# EAGLE schematic D-FlipFlop-countdown (EAGLE 9.6.2)
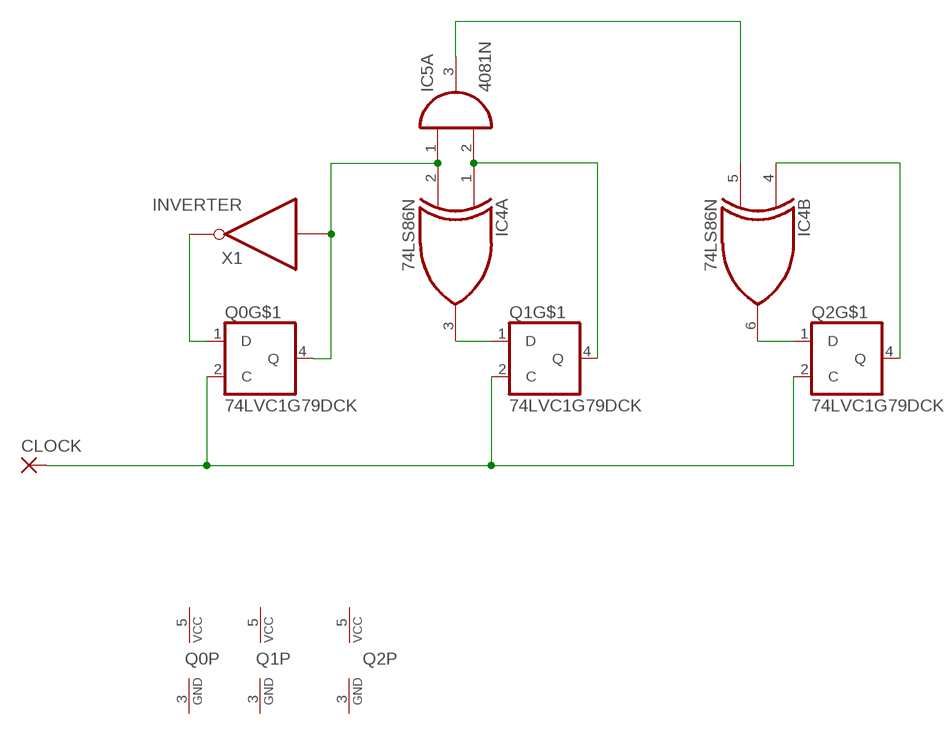
[diagram p0: schematic, sheet 1]

## Parts
CLOCK  1,6/0,8  [1,6/0,8]
IC4  74LS86N  [DIL14]
IC5  4081N  [DIL14]
Q0  74LVC1G79DCK  [SC70-5]
Q1  74LVC1G79DCK  [SC70-5]
Q2  74LVC1G79DCK  [SC70-5]
X1  INVERTER  (no package)

## Nets
N$1: CLOCK.1(P) Q0.2(C) Q1.2(C) Q2.2(C)
N$2: IC4.2(A:I1) IC5.1(A:I0) Q0.4(Q) X1.I
N$3: Q0.1(D) X1.O
N$4: IC4.1(A:I0) IC5.2(A:I1) Q1.4(Q)
N$5: IC4.3(A:O) Q1.1(D)
N$6: IC4.5(B:I1) IC5.3(A:O)
N$7: IC4.4(B:I0) Q2.4(Q)
N$8: IC4.6(B:O) Q2.1(D)
Unconnected: IC4.8(C:O) IC4.9(C:I0) IC4.10(C:I1) IC4.11(D:O) IC4.12(D:I0) IC4.13(D:I1) IC5.4(B:O) IC5.5(B:I0) IC5.6(B:I1) IC5.8(C:I0) IC5.9(C:I1) IC5.10(C:O) IC5.11(D:O) IC5.12(D:I0) IC5.13(D:I1)

## Power pins joined to a net without a drawn wire
GND: IC4.7(P:GND) Q0.3(GND) Q1.3(GND) Q2.3(GND)
VCC: IC4.14(P:VCC) Q0.5(VCC) Q1.5(VCC) Q2.5(VCC)
VDD: IC5.14(P:VDD)
VSS: IC5.7(P:VSS)

## Library data of the parts
CLOCK = wirepad:1,6/0,8: THROUGH-HOLE PAD
IC4 = 74xx-us:74*86: Quad 2-input EXCLUSIV-OR (XOR) gate
IC5 = 40xx:4081: Quad 2-input AND
Q0 Q1 Q2 = 74xx-little-de:74*1G79: Single Positive-Edge-Triggered D-Type Flip-Flop Source: Data sheet <http://www.ti.com/lit/ds/symlink/sn74lvc1g79.pdf>
X1 = ngspice-digital:INVERTER: logic inverter (NOT gate)